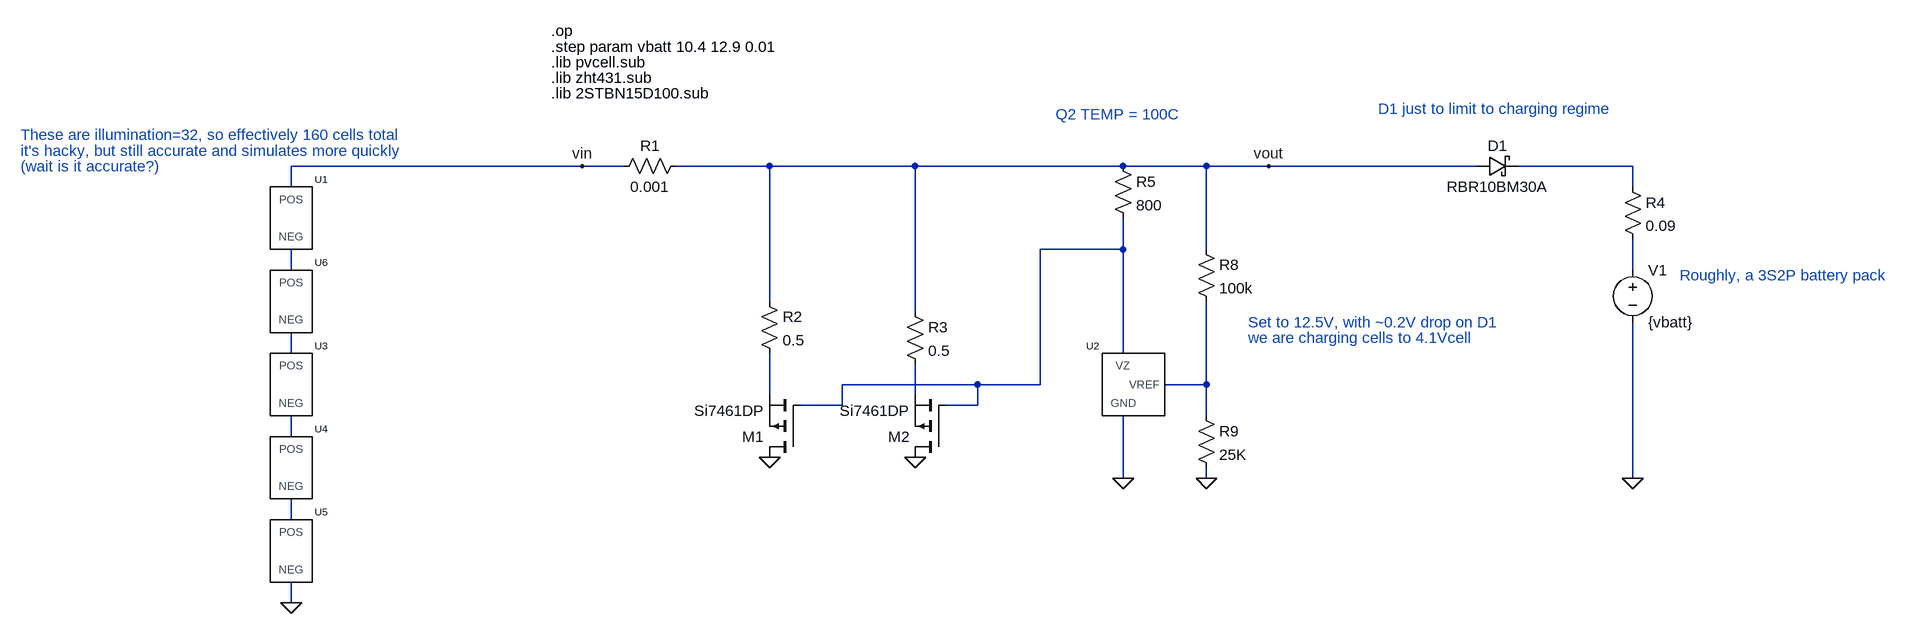
[diagram p0: schematic currentshunt-fet.asc]
currentshunt-fet.asc, the LTspice schematic file:
Version 4
SHEET 1 3156 2404
WIRE 96 32 -352 32
WIRE 160 32 96 32
WIRE 384 32 240 32
WIRE 608 32 384 32
WIRE 928 32 608 32
WIRE 1056 32 928 32
WIRE 1152 32 1056 32
WIRE 1472 32 1152 32
WIRE 1712 32 1536 32
WIRE -352 64 -352 32
WIRE 1712 64 1712 32
WIRE 928 160 928 112
WIRE 928 160 800 160
WIRE 1056 160 1056 32
WIRE -352 192 -352 160
WIRE 1712 192 1712 144
WIRE 384 240 384 32
WIRE 608 256 608 32
WIRE -352 320 -352 288
WIRE 928 320 928 160
WIRE 704 368 496 368
WIRE 800 368 800 160
WIRE 800 368 704 368
WIRE 1056 368 1056 240
WIRE 1056 368 992 368
WIRE 384 384 384 320
WIRE 608 384 608 336
WIRE 496 400 496 368
WIRE 496 400 432 400
WIRE 704 400 704 368
WIRE 704 400 656 400
WIRE 1056 416 1056 368
WIRE -352 448 -352 416
WIRE 928 512 928 416
WIRE 1056 512 1056 496
WIRE 1712 512 1712 272
WIRE -352 576 -352 544
WIRE -352 704 -352 672
FLAG 96 32 vin
FLAG 1056 512 0
FLAG -352 704 0
FLAG 1712 512 0
FLAG 1152 32 vout
FLAG 928 512 0
FLAG 608 480 0
FLAG 384 480 0
SYMBOL res 144 48 R270
WINDOW 0 32 56 VTop 2
WINDOW 3 0 56 VBottom 2
SYMATTR InstName R1
SYMATTR Value 0.001
SYMBOL res 1040 144 R0
SYMATTR InstName R8
SYMATTR Value 100k
SYMBOL res 1040 400 R0
SYMATTR InstName R9
SYMATTR Value 25K
SYMBOL pvcell -352 368 R0
SYMATTR InstName U3
SYMATTR Value2 Illumination=32
SYMBOL pvcell -352 496 R0
SYMATTR InstName U4
SYMATTR Value2 Illumination=32
SYMBOL pvcell -352 624 R0
SYMATTR InstName U5
SYMATTR Value2 Illumination=32
SYMBOL zht431 928 384 M0
SYMATTR InstName U2
SYMBOL pvcell -352 240 R0
SYMATTR InstName U6
SYMATTR Value2 Illumination=32
SYMBOL res 1696 48 R0
SYMATTR InstName R4
SYMATTR Value 0.09
SYMBOL voltage 1712 176 R0
WINDOW 123 0 0 Left 0
WINDOW 39 24 124 Left 2
SYMATTR InstName V1
SYMATTR Value {vbatt}
SYMBOL pvcell -352 112 R0
SYMATTR InstName U1
SYMATTR Value2 Illumination=32
SYMBOL schottky 1472 48 R270
WINDOW 0 32 32 VTop 2
WINDOW 3 0 32 VBottom 2
SYMATTR InstName D1
SYMATTR Value RBR10BM30A
SYMATTR Description Diode
SYMATTR Type diode
SYMBOL res 912 16 R0
SYMATTR InstName R5
SYMATTR Value 800
SYMBOL pmos 432 480 R180
SYMATTR InstName M1
SYMATTR Value Si7461DP
SYMBOL pmos 656 480 R180
SYMATTR InstName M2
SYMATTR Value Si7461DP
SYMATTR Value2 TEMP=100
SYMBOL res 368 224 R0
SYMATTR InstName R2
SYMATTR Value 0.5
SYMBOL res 592 240 R0
SYMATTR InstName R3
SYMATTR Value 0.5
TEXT 48 -176 Left 2 !.op
TEXT 48 -128 Left 2 !.lib pvcell.sub
TEXT 48 -104 Left 2 !.lib zht431.sub
TEXT 48 -152 Left 2 !.step param vbatt 10.4 12.9 0.01
TEXT 824 -48 Left 2 ;Q2 TEMP = 100C
TEXT 1784 200 Left 2 ;Roughly, a 3S2P battery pack
TEXT 1320 -56 Left 2 ;D1 just to limit to charging regime
TEXT 1120 272 Left 2 ;Set to 12.5V, with ~0.2V drop on D1
TEXT 1120 296 Left 2 ;we are charging cells to 4.1Vcell
TEXT 48 -80 Left 2 !.lib 2STBN15D100.sub
TEXT -768 -16 Left 2 ;These are illumination=32, so effectively 160 cells total
TEXT -768 8 Left 2 ;it's hacky, but still accurate and simulates more quickly
TEXT -768 32 Left 2 ;(wait is it accurate?)

The netlist it stands for:
* currentshunt-fet.asc
R1 vin vout 0.001
R8 vout N006 100k
R9 N006 0 25K
XU3 N009 N005 pvcell Illumination=32  ; pins NEG POS
XU4 N010 N009 pvcell Illumination=32  ; pins NEG POS
XU5 0 N010 pvcell Illumination=32  ; pins NEG POS
XU2 N002 N006 0 ZHT431  ; pins VZ VREF GND
XU6 N005 N003 pvcell Illumination=32  ; pins NEG POS
R4 N001 N004 0.09
V1 N004 0 {vbatt}
XU1 N003 vin pvcell Illumination=32  ; pins NEG POS
D1 vout N001 RBR10BM30A
R5 vout N002 800
M1 0 N002 N007 N007 Si7461DP
M2 0 N002 N008 N008 Si7461DP TEMP=100
R2 vout N007 0.5
R3 vout N008 0.5
.model D D
.lib standard.dio
.model NMOS NMOS
.model PMOS PMOS
.lib standard.mos
.op
.lib pvcell.sub
.lib zht431.sub
.step param vbatt 10.4 12.9 0.01
* Q2 TEMP = 100C
* Roughly, a 3S2P battery pack
* D1 just to limit to charging regime
* Set to 12.5V, with ~0.2V drop on D1
* we are charging cells to 4.1Vcell
.lib 2STBN15D100.sub
* These are illumination=32, so effectively 160 cells total
* it's hacky, but still accurate and simulates more quickly
* (wait is it accurate?)
.backanno
.end